# Altium schematic sheet PA stage 2.SchDoc
size A; SheetNumber: 9; SheetTotal: 12
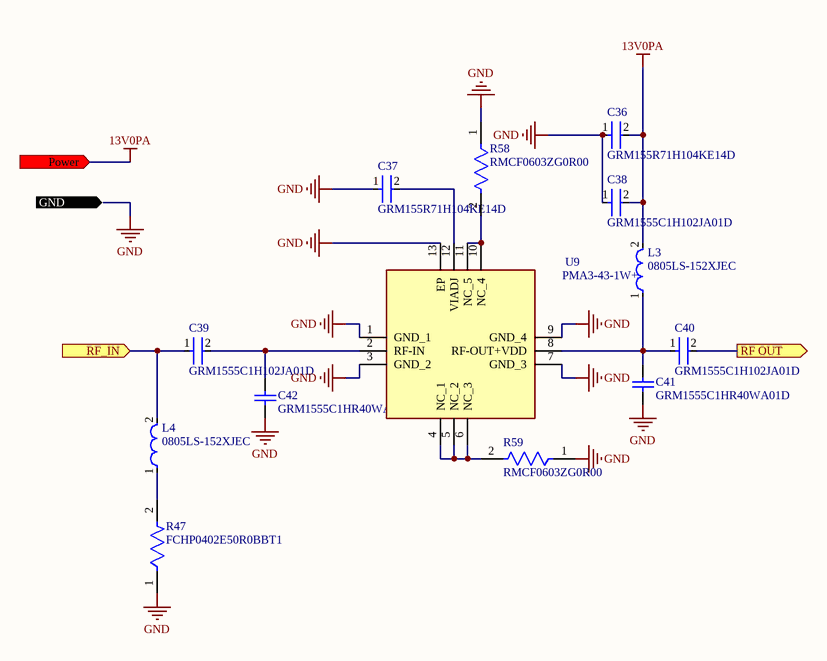
[diagram p0: PA stage 2.SchDoc]

## Parts
C36  GRM155R71H104KE14D  [FP-GRM155-0_05-IPC_B]
C37  GRM155R71H104KE14D  [FP-GRM155-0_05-IPC_B]
C38  GRM1555C1H102JA01D  [FP-GRM155-0_05-IPC_B]
C39  GRM1555C1H102JA01D  [FP-GRM155-0_05-IPC_B]
C40  GRM1555C1H102JA01D  [FP-GRM155-0_05-IPC_B]
C41  GRM1555C1HR40WA01D  [CAPC1005X55X25LL05T10]
C42  GRM1555C1HR40WA01D  [CAPC1005X55X25LL05T10]
L3  0805LS-152XJEC  [FP-LQW21HN_00-MFG]
L4  0805LS-152XJEC  [FP-LQW21HN_00-MFG]
R47  FCHP0402E50R0BBT1  [FP-FC0402-MFG]
R58  RMCF0603ZG0R00  [FP-RMCF0603-IPC_B]
R59  RMCF0603ZG0R00  [FP-RMCF0603-IPC_B]
U9  PMA3-43-1W+  [QFN51P300X300X89-13N]

## Ports
GND (in), Power (in), RF OUT (out), RF_IN (in)

## Nets
13V0PA: C36.2 C38.2 L3.2 ; port Power
GND: C36.1 C37.1 C38.1 C41.1 C42.1 R47.1 R58.1 R59.1 U9.1(GND_1) U9.3(GND_2) U9.7(GND_3) U9.9(GND_4) U9.13(EP) ; port GND
RF OUT: C40.2 ; port RF OUT
RF_IN: C39.1 L4.2 ; port RF_IN
NetC37_2: C37.2 U9.12(VIADJ)
NetC39_2: C39.2 C42.2 U9.2(RF-IN)
NetC40_1: C40.1 C41.2 L3.1 U9.8(RF-OUT+VDD)
NetL4_1: L4.1 R47.2
NetR58_2: R58.2 U9.10(NC_4) U9.11(NC_5)
NetR59_2: R59.2 U9.4(NC_1) U9.5(NC_2) U9.6(NC_3)

## Library data of the parts
C36 C37 = CMP-2008-04639-2: Chip Multilayer Ceramic Capacitors for General Purpose, 0402, 0.10uF, X7R, 15%, 10%, 50V; Dissipation Factor: 0.025%; Capacitance: 100nF; Weight: 0.000212oz; Thickness: 0.022inch; Voltage Rating (DC): 50V; Dielectric Material: Ceramic; Termination: SMD/SMT; Case/Package: 0402; Case Code (Imperial): 0402; Mount: Surface Mount; REACH SVHC: No SVHC; Resistor Type: Ceramic; Dielectric: X7R; Max Operating Temperature: 125°C; Voltage: 50V; Lead Free: Lead Free; Package Quantity: 10000; Packaging: Tape and Reel; Length: 1mm; Material: Ceramic; Height: 0.5mm; Depth: 0.5mm; Width: 0.5mm; Min Operating Temperature: -55°C; Tolerance: 10%; Case Code (Metric): 1005; Voltage Rating: 50V
C38-C40 = CMP-2008-04254-2: Chip Multilayer Ceramic Capacitors for General Purpose, 0402, 1000pF, C0G, 30ppm/°C, 5%, 50V; Insulation Resistance: 10GR; Capacitance: 1nF; Packaging: Tape and Reel; Lead Free: Lead Free; Tolerance: 5%; Temperature Coefficient: 30ppm/°C; Thickness: 0.022inch; Termination: SMD/SMT; Max Operating Temperature: 125°C; Height: 0.5mm; Package Quantity: 1; Radiation Hardening: No; Material: Ceramic; Case Code (Metric): 1005; Number of Pins: 2; Voltage Rating: 50V; Mount: Surface Mount; Voltage: 50V; Case/Package: 0402; Min Operating Temperature: -55°C; Dielectric Material: Ceramic; Width: 0.5mm; Depth: 0.5mm; Case Code (Imperial): 0402; REACH SVHC: No SVHC; Dielectric: C0G; Voltage Rating (DC): 50V; Length: 1mm
C41 C42 = CMP-1034-00010-2: Manufacturer: Murata; Part Number: GRM1555C1HR40WA01D
L3 L4 = CMP-06042-001639-1: 0805LS-152XJEC Coilcraft; Core Material: Ferrite; DC Current: 85mA; DC Resistance (DCR): 5.33R; Self Resonant Frequency: 350MHz; Shielding: Unshielded; Inductance: 1.5uH; Test Frequency: 10MHz; Tolerance: 5%; Q Factor: 35; Width: 0.047inch; Case Code (Metric): 2012; Current Rating: 85mA; Mount: Surface Mount; Max DC Current: 85mA; Length: 2mm; Height - Seated (Max): 0.039inch; Depth: 1.4mm; Min Operating Temperature: -40°C; Termination: SMD/SMT; Military Standard: Not; Radiation Hardening: No; Packaging: Tape and Reel; Resistor Type: Wirewound; Case/Package: 0805; Case Code (Imperial): 0805; Weight: 0.000282oz; Height: 0.9mm; Package Quantity: 3000; Max Operating Temperature: 85°C
R47 = CMP-05494-120702529-1: FCHP0402E50R0BBT1 SMD Chip Resistor, 50 Ohm, ± 0.1%, 1 W, 0402 [1005 Metric], Thin Film, High Frequency; Power Rating: 1W; Voltage Rating: 30V; Temperature Coefficient: 25ppm/°C; Resistance: 50Ω; Max Operating Temperature: 155°C; Min Operating Temperature: -55°C; Composition: Thin Film; Schedule B: 8533210045; Case/Package: 0402; Tolerance: 0.1%; Height: 419.1µm; NexarPartId: 120702529
R58 R59 = CMP-26527-006412-1: 0Ω ±0 0.1W 0603 Thick Film Chip Resistor AEC-Q200 compliant; Max Power Dissipation: 100mW; Resistance: 0R; Width: 0.031inch; RoHS Compliant: Yes; Number of Terminations: 2; Case/Package: 0603; Contact Plating: Tin; Height: 0.022inch; Resistor Type: Thick Film; Mount: Surface Mount; Length: 0.061inch; Features: Automotive AEC-Q200; Series: RMCF; Max Operating Temperature: 155°C; Radiation Hardening: No; Min Operating Temperature: -55°C; Packaging: Tape and Reel
U9 = PMA3-43-1W+: Integrated Circuit; Manufacturer_Name: Mini-Circuits; Datasheet Link: https://www.minicircuits.com/pdfs/PMA3-43-1W+.pdf; Height: 0.89mm; Manufacturer_Part_Number: PMA3-43-1W+